# EAGLE board keyboard (EAGLE 9.6.1), part 1 of 3
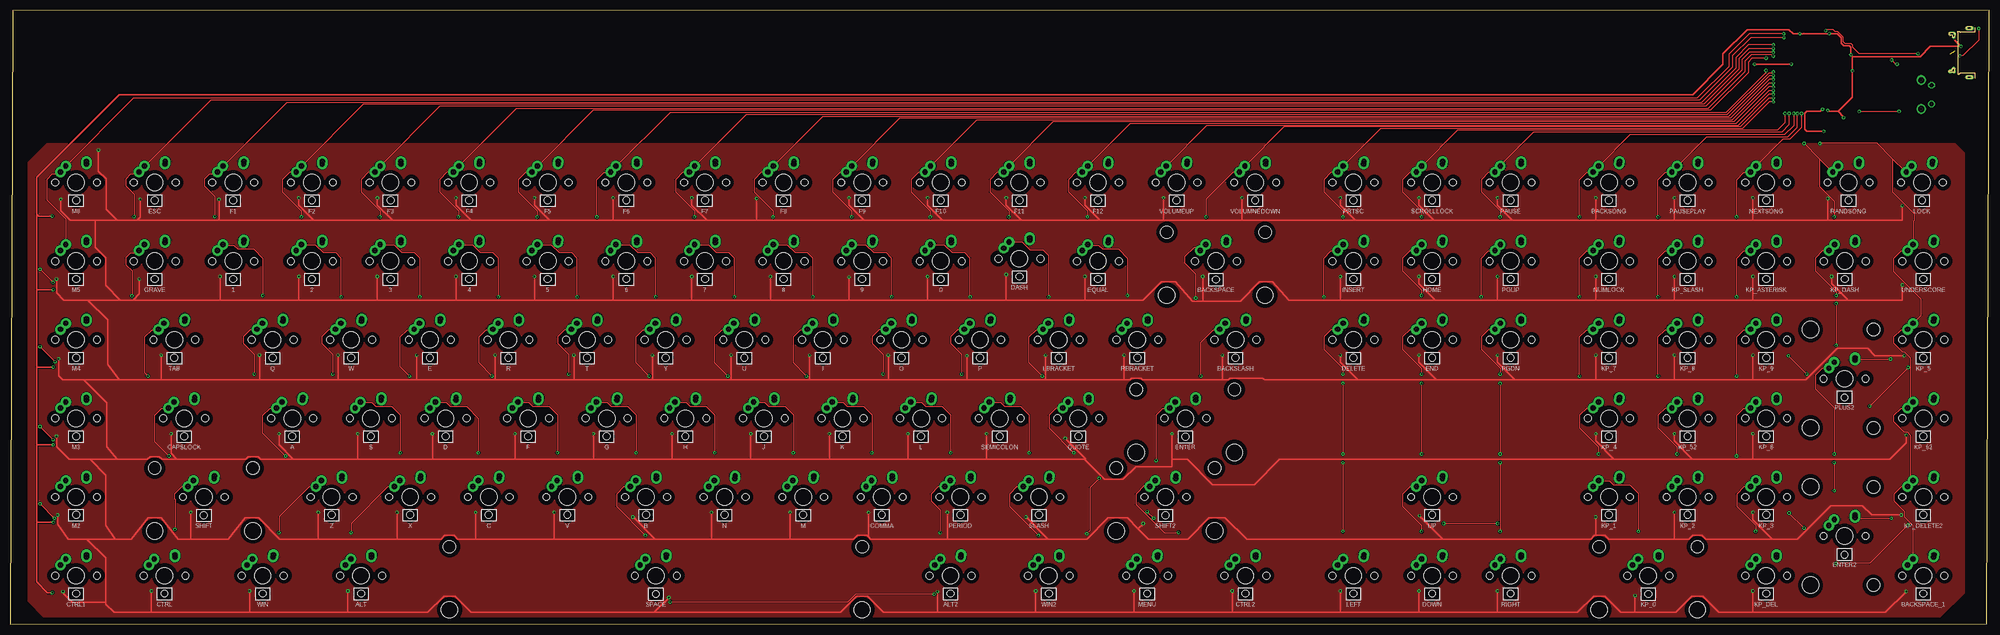
[diagram p6: board, top side]
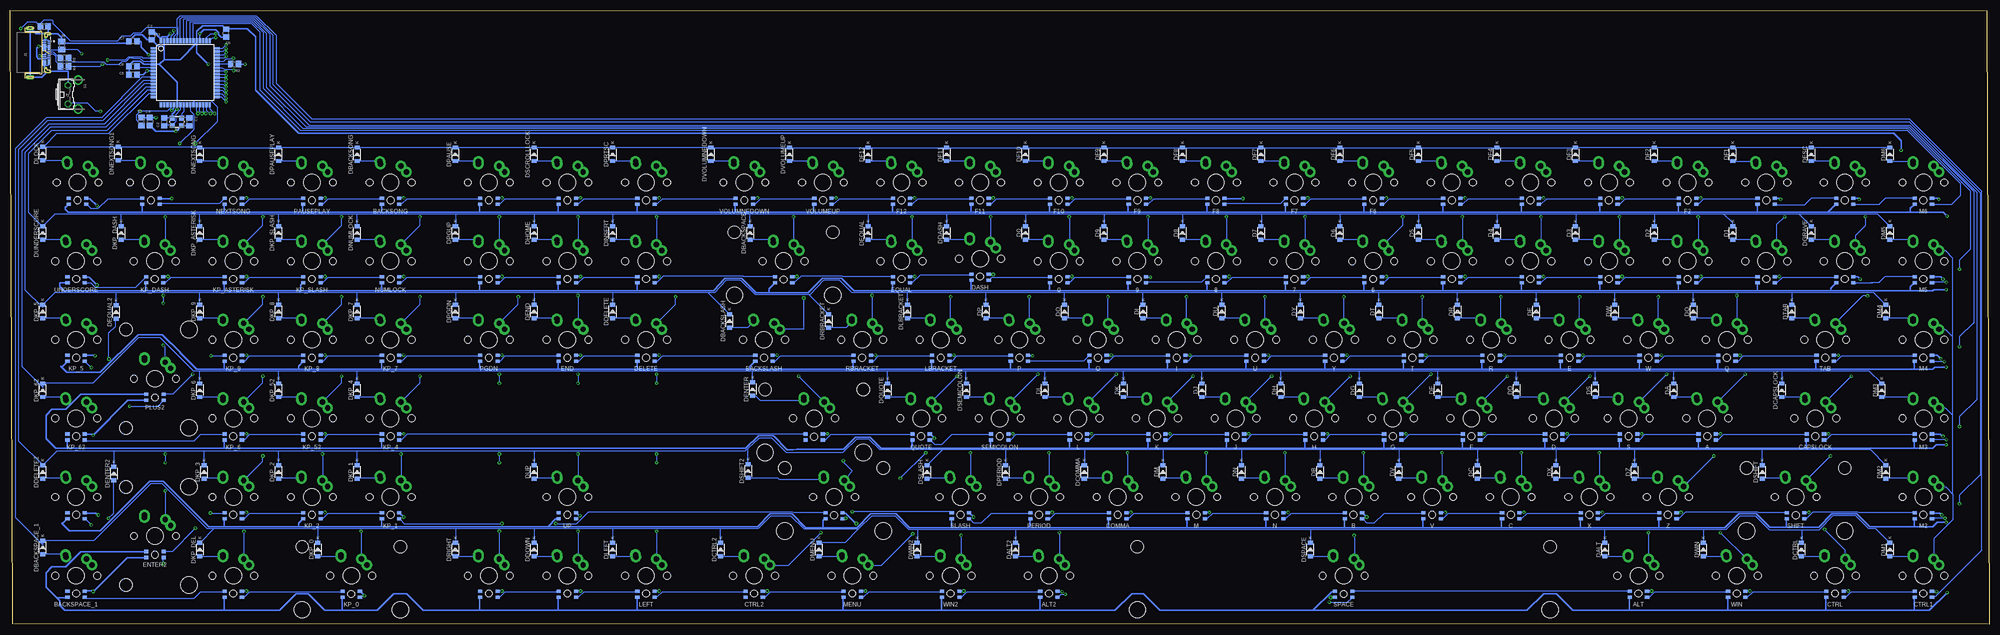
[diagram p7: board, bottom side, seen from below]

Size 479.57 x 148.74 mm. Coordinates in mm from the lower left corner, seen from the top.
Outline: 0,0 479.01,0.14 479.57,148.74 0.56,148.6 0,0
Copper layers (1*16): Top 0.035mm / dielectric 1.5mm / Bottom 0.035mm
Design rules "default *": minimum track width 6mil, minimum drill 0.35mm, track to track 6mil, track to pad 6mil, pad to pad 6mil, via to via 6mil, smd to smd 6mil, copper to edge 40mil, drill to drill 6mil, minimum pad ring 10mil, minimum via ring 8mil, stop-mask expansion 4mil, vias tented up to drill 0mil, thermal gap 10mil
Net classes: 0 default: width 0.2 mm; 1 POWER: width 0.406 mm

## Footprints (pad centres in the part's own frame; a part is rotated, then mirrored left to right if it is on the bottom)
ALPSMX-1U-SMDRGB = drill 1.3 pad 2.54: ALPS1 -2.5,4; ALPS2 2.5,4.5; MX1 -3.81,2.54; MX2 2.54,5.08 | smd 1 x 0.75 bottom: DIN -2.1,-5.225; DOUT 2.1,-3.775; VDD 2.1,-5.225; VSS -2.1,-3.775 | hole 4: 0,0 | hole 1.7: -5.08,0; 5.08,0; 0,-4.318
ALPSMX-2U-SMDRGB = drill 1.3 pad 2.54: ALPS1 -2.5,4; ALPS2 2.5,4.5; MX1 -3.81,2.54; MX2 2.54,5.08 | smd 1 x 0.75 bottom: DIN -2.1,-5.225; DOUT 2.1,-3.775; VDD 2.1,-5.225; VSS -2.1,-3.775 | hole 4: 0,0; -11.9,-8.24; 11.9,-8.24 | hole 1.7: -5.08,0; 5.08,0; 0,-4.445 | hole 3.05: -11.9,7; 11.9,7
C0805 = smd 1.3 x 1.5: 1 -0.95,0; 2 0.95,0
SOD-123 = smd 0.91 x 1.22: A -1.635,0; C 1.635,0
ALPSMX-2U-SMDRGB-ROTATED = drill 1.3 pad 2.54: ALPS1 -2.5,4; ALPS2 2.5,4.5; MX1 -3.81,2.54; MX2 2.54,5.08 | smd 1 x 0.75 bottom: DIN -2.1,-5.225; DOUT 2.1,-3.775; VDD 2.1,-5.225; VSS -2.1,-3.775 | hole 4: 0,0; -8.24,-11.9; -8.24,11.9 | hole 1.7: -5.08,0; 5.08,0; 0,-4.572 | hole 3.05: 7,-11.9; 7,11.9
TQFP64 = smd 1.194 x 0.559: 1 -7.76,5.905; 2 -7.76,5.118; 3 -7.76,4.331; 4 -7.76,3.543; 5 -7.76,2.756; 6 -7.76,1.968; 7 -7.76,1.181; 8 -7.76,0.394; 9 -7.76,-0.394; 10 -7.76,-1.181; 11 -7.76,-1.968; 12 -7.76,-2.756; 13 -7.76,-3.543; 14 -7.76,-4.331; 15 -7.76,-5.118; 16 -7.76,-5.905; 33 7.76,-5.905; 34 7.76,-5.118; 35 7.76,-4.331; 36 7.76,-3.543; 37 7.76,-2.756; 38 7.76,-1.968; 39 7.76,-1.181; 40 7.76,-0.394; 41 7.76,0.394; 42 7.76,1.181; 43 7.76,1.968; 44 7.76,2.756; 45 7.76,3.543; 46 7.76,4.331; 47 7.76,5.118; 48 7.76,5.905 | smd 0.559 x 1.194: 17 -5.905,-7.76; 18 -5.118,-7.76; 19 -4.331,-7.76; 20 -3.543,-7.76; 21 -2.756,-7.76; 22 -1.968,-7.76; 23 -1.181,-7.76; 24 -0.394,-7.76; 25 0.394,-7.76; 26 1.181,-7.76; 27 1.968,-7.76; 28 2.756,-7.76; 29 3.543,-7.76; 30 4.331,-7.76; 31 5.118,-7.76; 32 5.905,-7.76; 49 5.905,7.76; 50 5.118,7.76; 51 4.331,7.76; 52 3.543,7.76; 53 2.756,7.76; 54 1.968,7.76; 55 1.181,7.76; 56 0.394,7.76; 57 -0.394,7.76; 58 -1.181,7.76; 59 -1.968,7.76; 60 -2.756,7.76; 61 -3.543,7.76; 62 -4.331,7.76; 63 -5.118,7.76; 64 -5.905,7.76
TE_1-2295018-2 = smd 0.3 x 0.8: A1 -2.75,4.63; A2 -2.25,4.63; A3 -1.75,4.63; A4 -1.25,4.63; A5 -0.75,4.63; A6 -0.25,4.63; A7 0.25,4.63; A8 0.75,4.63; A9 1.25,4.63; A10 1.75,4.63; A11 2.25,4.63; A12 2.75,4.63; B1 3,3.43; B2 2.5,3.43; B3 2,3.43; B4 1.5,3.43; B5 1,3.43; B6 0.5,3.43; B7 -0.5,3.43; B8 -1,3.43; B9 -1.5,3.43; B10 -2,3.43; B11 -2.5,3.43; B12 -3,3.43 | drill 0.5 long: P1_1 -4.55,4.22; P2_1 4.55,4.22 | drill 0.35 long: P1_2 -4.191,3.795; P2_2 4.191,3.795 | drill 0.5 pad 1.1 long: P4 -5.97,0; P5 5.97,0
M0805 = smd 1.3 x 1.6: 1 -0.95,0; 2 0.95,0
B3F-31XX = drill 1.016 octagon: 1 -2.261,-1.245; 2 2.261,-1.245 | drill 1.499 pad 2.159: 3 -3.505,1.245; 4 3.505,1.245
ALPSMX-6.25U-SMDRGB = drill 1.3 pad 2.54: ALPS1 -2.5,4; ALPS2 2.5,4.5; MX1 -3.81,2.54; MX2 2.54,5.08 | smd 1 x 0.75 bottom: DIN 2.1,-3.775; DOUT -2.1,-5.225; VDD 2.1,-5.225; VSS -2.1,-3.775 | hole 4: 0,0; -50,-8.24; 50,-8.24 | hole 1.7: -5.08,0; 5.08,0; 0,-4.445 | hole 3.05: -50,7; 50,7
CRYSTAL-SMD-3.2X2.5MM = smd 1.2 x 1.1: 1 -1.175,-0.875; 2 1.175,-0.875; 3 1.175,0.875; 4 -1.175,0.875

## Placement (x,y rotation side)
0  KEYSWITCH-RGBSMDLED-ALPSMX-1U-SMDRGB  [ALPSMX-1U-SMDRGB]  225.49,87.97 0 top
1  KEYSWITCH-RGBSMDLED-ALPSMX-1U-SMDRGB  [ALPSMX-1U-SMDRGB]  54.04,87.97 0 top
2  KEYSWITCH-RGBSMDLED-ALPSMX-1U-SMDRGB  [ALPSMX-1U-SMDRGB]  73.09,87.97 0 top
3  KEYSWITCH-RGBSMDLED-ALPSMX-1U-SMDRGB  [ALPSMX-1U-SMDRGB]  92.14,87.97 0 top
4  KEYSWITCH-RGBSMDLED-ALPSMX-1U-SMDRGB  [ALPSMX-1U-SMDRGB]  111.19,87.97 0 top
5  KEYSWITCH-RGBSMDLED-ALPSMX-1U-SMDRGB  [ALPSMX-1U-SMDRGB]  130.24,87.97 0 top
6  KEYSWITCH-RGBSMDLED-ALPSMX-1U-SMDRGB  [ALPSMX-1U-SMDRGB]  149.29,87.97 0 top
7  KEYSWITCH-RGBSMDLED-ALPSMX-1U-SMDRGB  [ALPSMX-1U-SMDRGB]  168.34,87.97 0 top
8  KEYSWITCH-RGBSMDLED-ALPSMX-1U-SMDRGB  [ALPSMX-1U-SMDRGB]  187.39,87.97 0 top
9  KEYSWITCH-RGBSMDLED-ALPSMX-1U-SMDRGB  [ALPSMX-1U-SMDRGB]  206.44,87.97 0 top
A  KEYSWITCH-RGBSMDLED-ALPSMX-1U-SMDRGB  [ALPSMX-1U-SMDRGB]  68.33,49.87 0 top
ALT  KEYSWITCH-RGBSMDLED-ALPSMX-1U-SMDRGB  [ALPSMX-1U-SMDRGB]  85,11.77 0 top
ALT2  KEYSWITCH-RGBSMDLED-ALPSMX-1U-SMDRGB  [ALPSMX-1U-SMDRGB]  227.87,11.77 0 top
B  KEYSWITCH-RGBSMDLED-ALPSMX-1U-SMDRGB  [ALPSMX-1U-SMDRGB]  154.05,30.82 0 top
BACKSLASH  KEYSWITCH-RGBSMDLED-ALPSMX-1U-SMDRGB  [ALPSMX-1U-SMDRGB]  296.93,68.92 0 top
BACKSONG  KEYSWITCH-RGBSMDLED-ALPSMX-1U-SMDRGB  [ALPSMX-1U-SMDRGB]  387.42,107.02 0 top
BACKSPACE  KEYSWITCH-RGBSMDLED-ALPSMX-2U-SMDRGB  [ALPSMX-2U-SMDRGB]  292.17,87.97 0 top
BACKSPACE_1  KEYSWITCH-RGBSMDLED-ALPSMX-1U-SMDRGB  [ALPSMX-1U-SMDRGB]  463.62,11.77 0 top
C  KEYSWITCH-RGBSMDLED-ALPSMX-1U-SMDRGB  [ALPSMX-1U-SMDRGB]  115.95,30.82 0 top
C1  22pF  [C0805]  436.14,121.72 270 bottom
C2  22pF  [C0805]  442.24,121.72 90 bottom
C3  0.1uF  [C0805]  445.29,142.57 270 bottom
C4  0.1uF  [C0805]  445.77,121.82 270 bottom
C5  0.1uF  [C0805]  449.86,133.12 180 bottom
C6  0.1uF  [C0805]  427.28,143.2 90 bottom
C7  0.1uF  [C0805]  449.86,141.27 180 bottom
C8  1u  [C0805]  449.86,135.18 0 bottom
CAPSLOCK  KEYSWITCH-RGBSMDLED-ALPSMX-1U-SMDRGB  [ALPSMX-1U-SMDRGB]  42.13,49.87 0 top
COMMA  KEYSWITCH-RGBSMDLED-ALPSMX-1U-SMDRGB  [ALPSMX-1U-SMDRGB]  211.2,30.82 0 top
CTRL  KEYSWITCH-RGBSMDLED-ALPSMX-1U-SMDRGB  [ALPSMX-1U-SMDRGB]  37.37,11.77 0 top
CTRL1  KEYSWITCH-RGBSMDLED-ALPSMX-1U-SMDRGB  [ALPSMX-1U-SMDRGB]  15.94,11.77 0 top
CTRL2  KEYSWITCH-RGBSMDLED-ALPSMX-1U-SMDRGB  [ALPSMX-1U-SMDRGB]  299.31,11.77 0 top
D  KEYSWITCH-RGBSMDLED-ALPSMX-1U-SMDRGB  [ALPSMX-1U-SMDRGB]  105.51,49.87 0 top
D0  [SOD-123]  233.6,94.81 90 bottom
D1  [SOD-123]  62.15,94.81 90 bottom
D2  [SOD-123]  81.2,94.81 90 bottom
D3  [SOD-123]  100.25,94.81 90 bottom
D4  [SOD-123]  119.3,94.81 90 bottom
D5  [SOD-123]  138.35,94.81 90 bottom
D6  [SOD-123]  157.4,94.81 90 bottom
D7  [SOD-123]  176.45,94.81 90 bottom
D8  [SOD-123]  195.5,94.81 90 bottom
D9  [SOD-123]  214.55,94.81 90 bottom
DA  [SOD-123]  76.44,56.71 90 bottom
DALT  [SOD-123]  93.11,18.1 90 bottom
DALT2  [SOD-123]  235.98,18.1 90 bottom
DASH  KEYSWITCH-RGBSMDLED-ALPSMX-1U-SMDRGB  [ALPSMX-1U-SMDRGB]  244.54,88.57 0 top
DB  [SOD-123]  162.16,36.89 90 bottom
DBACKSLASH  [SOD-123]  305.3,73.47 90 bottom
DBACKSONG  [SOD-123]  395.53,113.86 90 bottom
DBACKSPACE  [SOD-123]  300.28,94.81 90 bottom
DBACKSPACE_1  [SOD-123]  471.73,18.61 90 bottom
DC  [SOD-123]  124.06,36.89 90 bottom
DCAPSLOCK  [SOD-123]  50.24,56.71 90 bottom
DCOMMA  [SOD-123]  219.31,36.89 90 bottom
DCTRL  [SOD-123]  45.48,18.1 90 bottom
DCTRL2  [SOD-123]  307.42,18.1 90 bottom
DD  [SOD-123]  114.54,56.71 90 bottom
DDASH  [SOD-123]  252.65,94.81 90 bottom
DDELETE  [SOD-123]  333.61,75.76 90 bottom
DDELETE2  [SOD-123]  471.73,36.89 90 bottom
DDOWN  [SOD-123]  352.66,18.1 90 bottom
DE  [SOD-123]  109.78,75.76 90 bottom
DELETE  KEYSWITCH-RGBSMDLED-ALPSMX-1U-SMDRGB  [ALPSMX-1U-SMDRGB]  325.5,68.92 0 top
DEND  [SOD-123]  352.66,75.76 90 bottom
DENTER  [SOD-123]  299.67,56.96 90 bottom
DENTER2  [SOD-123]  454.46,36.52 90 bottom
DEQUAL  [SOD-123]  271.7,94.81 90 bottom
DEQUAL2  [SOD-123]  453.95,75.63 90 bottom
DESC  [SOD-123]  43.1,113.86 90 bottom
DF  [SOD-123]  133.59,56.71 90 bottom
DF1  [SOD-123]  62.15,113.86 90 bottom
DF2  [SOD-123]  81.2,113.86 90 bottom
DF3  [SOD-123]  100.25,113.86 90 bottom
DF4  [SOD-123]  119.3,113.86 90 bottom
DF5  [SOD-123]  138.35,113.86 90 bottom
DF6  [SOD-123]  157.4,113.86 90 bottom
DF7  [SOD-123]  176.45,113.86 90 bottom
DF8  [SOD-123]  195.5,113.86 90 bottom
DF9  [SOD-123]  214.55,113.86 90 bottom
DF10  [SOD-123]  233.6,113.86 90 bottom
DF11  [SOD-123]  252.65,113.86 90 bottom
DF12  [SOD-123]  271.7,113.86 90 bottom
DG  [SOD-123]  152.64,56.71 90 bottom
DGRAVE  [SOD-123]  43.1,94.81 90 bottom
DH  [SOD-123]  171.69,56.71 90 bottom
DHOME  [SOD-123]  352.66,94.81 90 bottom
DI  [SOD-123]  205.03,75.76 90 bottom
DINSERT  [SOD-123]  333.61,94.81 90 bottom
DJ  [SOD-123]  190.74,56.71 90 bottom
DK  [SOD-123]  209.79,56.71 90 bottom
DKP_0  [SOD-123]  405.05,18.1 90 bottom
DKP_1  [SOD-123]  395.53,36.89 90 bottom
DKP_2  [SOD-123]  414.58,36.89 90 bottom
DKP_3  [SOD-123]  432.62,36.89 90 bottom
DKP_4  [SOD-123]  395.53,56.71 90 bottom
DKP_5  [SOD-123]  471.73,75.76 90 bottom
DKP_6  [SOD-123]  433.63,56.71 90 bottom
DKP_7  [SOD-123]  395.53,75.76 90 bottom
DKP_8  [SOD-123]  414.58,75.76 90 bottom
DKP_9  [SOD-123]  433.63,75.76 90 bottom
DKP_52  [SOD-123]  414.58,56.71 90 bottom
DKP_62  [SOD-123]  471.73,56.71 90 bottom
DKP_ASTERISK  [SOD-123]  433.63,94.81 90 bottom
DKP_DASH  [SOD-123]  452.68,94.81 90 bottom
DKP_DEL  [SOD-123]  433.63,18.1 90 bottom
DKP_SLASH  [SOD-123]  414.58,94.81 90 bottom
DL  [SOD-123]  228.84,56.71 90 bottom
DLBRACKET  [SOD-123]  262.18,75.76 90 bottom
DLEFT  [SOD-123]  333.61,18.1 90 bottom
DLOCK  [SOD-123]  471.73,114.07 90 bottom
DM  [SOD-123]  200.26,36.89 90 bottom
DM1  [SOD-123]  24.05,18.1 90 bottom
DM2  [SOD-123]  25.05,36.89 90 bottom
DM3  [SOD-123]  26.05,56.71 90 bottom
DM4  [SOD-123]  25.05,75.76 90 bottom
DM5  [SOD-123]  24.05,94.81 90 bottom
DM6  [SOD-123]  24.05,113.86 90 bottom
DMENU  [SOD-123]  283.61,18.1 90 bottom
DN  [SOD-123]  181.21,36.89 90 bottom
DNEXTSONG  [SOD-123]  433.63,113.86 90 bottom
DNEXTSONG1  [SOD-123]  453.47,114.07 90 bottom
DNUMLOCK  [SOD-123]  395.53,94.81 90 bottom
DO  [SOD-123]  224.08,75.76 90 bottom
DOWN  KEYSWITCH-RGBSMDLED-ALPSMX-1U-SMDRGB  [ALPSMX-1U-SMDRGB]  344.55,11.77 0 top
DP  [SOD-123]  243.13,75.76 90 bottom
DPAUSE  [SOD-123]  371.71,113.86 90 bottom
DPAUSEPLAY  [SOD-123]  414.58,113.86 90 bottom
DPERIOD  [SOD-123]  238.36,36.89 90 bottom
DPGDN  [SOD-123]  371.71,75.76 90 bottom
DPGUP  [SOD-123]  371.71,94.81 90 bottom
DPRTSC  [SOD-123]  333.61,113.86 90 bottom
DQ  [SOD-123]  71.68,75.76 90 bottom
DQUOTE  [SOD-123]  266.94,56.71 90 bottom
DR  [SOD-123]  128.83,75.76 90 bottom
DRBRACKET  [SOD-123]  281.23,73.47 90 bottom
DRIGHT  [SOD-123]  371.71,18.1 90 bottom
DS  [SOD-123]  95.49,56.71 90 bottom
DSCROLLLOCK  [SOD-123]  352.66,113.86 90 bottom
DSEMICOLON  [SOD-123]  247.89,56.71 90 bottom
DSHIFT  [SOD-123]  55.01,36.89 90 bottom
DSHIFT2  [SOD-123]  300.75,37.15 90 bottom
DSLASH  [SOD-123]  257.41,36.89 90 bottom
DSPACE  [SOD-123]  164.54,18.1 90 bottom
DT  [SOD-123]  147.88,75.76 90 bottom
DTAB  [SOD-123]  47.86,75.76 90 bottom
DU  [SOD-123]  185.98,75.76 90 bottom
DUNDERSCORE  [SOD-123]  471.73,94.81 90 bottom
DUP  [SOD-123]  352.66,36.89 90 bottom
DV  [SOD-123]  143.11,36.89 90 bottom
DVOLUMEUP  [SOD-123]  290.75,113.86 90 bottom
DVOLUMNEDOWN  [SOD-123]  309.8,113.86 90 bottom
DW  [SOD-123]  90.73,75.76 90 bottom
DWIN  [SOD-123]  69.29,18.1 90 bottom
DWIN2  [SOD-123]  259.79,18.1 90 bottom
DX  [SOD-123]  105.01,36.89 90 bottom
DY  [SOD-123]  166.93,75.76 90 bottom
DZ  [SOD-123]  85.96,36.89 90 bottom
E  KEYSWITCH-RGBSMDLED-ALPSMX-1U-SMDRGB  [ALPSMX-1U-SMDRGB]  101.67,68.92 0 top
END  KEYSWITCH-RGBSMDLED-ALPSMX-1U-SMDRGB  [ALPSMX-1U-SMDRGB]  344.55,68.92 0 top
ENTER  KEYSWITCH-RGBSMDLED-ALPSMX-2U-SMDRGB  [ALPSMX-2U-SMDRGB]  284.77,49.87 0 top
ENTER2  KEYSWITCH-RGBSMDLED-ALPSMX-2U-SMDRGB-ROTATED  [ALPSMX-2U-SMDRGB-ROTATED]  444.52,21.39 0 top
EQUAL  KEYSWITCH-RGBSMDLED-ALPSMX-1U-SMDRGB  [ALPSMX-1U-SMDRGB]  263.59,87.97 0 top
ESC  KEYSWITCH-RGBSMDLED-ALPSMX-1U-SMDRGB  [ALPSMX-1U-SMDRGB]  34.99,107.02 0 top
F  KEYSWITCH-RGBSMDLED-ALPSMX-1U-SMDRGB  [ALPSMX-1U-SMDRGB]  125.48,49.87 0 top
F1  KEYSWITCH-RGBSMDLED-ALPSMX-1U-SMDRGB  [ALPSMX-1U-SMDRGB]  54.04,107.02 0 top
F2  KEYSWITCH-RGBSMDLED-ALPSMX-1U-SMDRGB  [ALPSMX-1U-SMDRGB]  73.09,107.02 0 top
F3  KEYSWITCH-RGBSMDLED-ALPSMX-1U-SMDRGB  [ALPSMX-1U-SMDRGB]  92.14,107.02 0 top
F4  KEYSWITCH-RGBSMDLED-ALPSMX-1U-SMDRGB  [ALPSMX-1U-SMDRGB]  111.19,107.02 0 top
F5  KEYSWITCH-RGBSMDLED-ALPSMX-1U-SMDRGB  [ALPSMX-1U-SMDRGB]  130.24,107.02 0 top
F6  KEYSWITCH-RGBSMDLED-ALPSMX-1U-SMDRGB  [ALPSMX-1U-SMDRGB]  149.29,107.02 0 top
F7  KEYSWITCH-RGBSMDLED-ALPSMX-1U-SMDRGB  [ALPSMX-1U-SMDRGB]  168.34,107.02 0 top
F8  KEYSWITCH-RGBSMDLED-ALPSMX-1U-SMDRGB  [ALPSMX-1U-SMDRGB]  187.39,107.02 0 top
F9  KEYSWITCH-RGBSMDLED-ALPSMX-1U-SMDRGB  [ALPSMX-1U-SMDRGB]  206.44,107.02 0 top
F10  KEYSWITCH-RGBSMDLED-ALPSMX-1U-SMDRGB  [ALPSMX-1U-SMDRGB]  225.49,107.02 0 top
F11  KEYSWITCH-RGBSMDLED-ALPSMX-1U-SMDRGB  [ALPSMX-1U-SMDRGB]  244.54,107.02 0 top
F12  KEYSWITCH-RGBSMDLED-ALPSMX-1U-SMDRGB  [ALPSMX-1U-SMDRGB]  263.59,107.02 0 top
G  KEYSWITCH-RGBSMDLED-ALPSMX-1U-SMDRGB  [ALPSMX-1U-SMDRGB]  144.53,49.87 0 top
GRAVE  KEYSWITCH-RGBSMDLED-ALPSMX-1U-SMDRGB  [ALPSMX-1U-SMDRGB]  34.99,87.97 0 top
H  KEYSWITCH-RGBSMDLED-ALPSMX-1U-SMDRGB  [ALPSMX-1U-SMDRGB]  163.58,49.87 0 top
HOME  KEYSWITCH-RGBSMDLED-ALPSMX-1U-SMDRGB  [ALPSMX-1U-SMDRGB]  344.55,87.97 0 top
I  KEYSWITCH-RGBSMDLED-ALPSMX-1U-SMDRGB  [ALPSMX-1U-SMDRGB]  196.92,68.92 0 top
IC3  [TQFP64]  437.16,133.65 0 bottom
INSERT  KEYSWITCH-RGBSMDLED-ALPSMX-1U-SMDRGB  [ALPSMX-1U-SMDRGB]  325.5,87.97 0 top
J  KEYSWITCH-RGBSMDLED-ALPSMX-1U-SMDRGB  [ALPSMX-1U-SMDRGB]  182.63,49.87 0 top
J1  1-2295018-2  [TE_1-2295018-2]  474.75,138.48 270 bottom
K  KEYSWITCH-RGBSMDLED-ALPSMX-1U-SMDRGB  [ALPSMX-1U-SMDRGB]  201.68,49.87 0 top
KP_0  KEYSWITCH-RGBSMDLED-ALPSMX-2U-SMDRGB  [ALPSMX-2U-SMDRGB]  396.94,11.77 0 top
KP_1  KEYSWITCH-RGBSMDLED-ALPSMX-1U-SMDRGB  [ALPSMX-1U-SMDRGB]  387.42,30.82 0 top
KP_2  KEYSWITCH-RGBSMDLED-ALPSMX-1U-SMDRGB  [ALPSMX-1U-SMDRGB]  406.47,30.82 0 top
KP_3  KEYSWITCH-RGBSMDLED-ALPSMX-1U-SMDRGB  [ALPSMX-1U-SMDRGB]  425.52,30.82 0 top
KP_4  KEYSWITCH-RGBSMDLED-ALPSMX-1U-SMDRGB  [ALPSMX-1U-SMDRGB]  387.42,49.87 0 top
KP_5  KEYSWITCH-RGBSMDLED-ALPSMX-1U-SMDRGB  [ALPSMX-1U-SMDRGB]  463.62,68.92 0 top
KP_6  KEYSWITCH-RGBSMDLED-ALPSMX-1U-SMDRGB  [ALPSMX-1U-SMDRGB]  425.52,49.87 0 top
KP_7  KEYSWITCH-RGBSMDLED-ALPSMX-1U-SMDRGB  [ALPSMX-1U-SMDRGB]  387.42,68.92 0 top
KP_8  KEYSWITCH-RGBSMDLED-ALPSMX-1U-SMDRGB  [ALPSMX-1U-SMDRGB]  406.47,68.92 0 top
KP_9  KEYSWITCH-RGBSMDLED-ALPSMX-1U-SMDRGB  [ALPSMX-1U-SMDRGB]  425.52,68.92 0 top
KP_52  KEYSWITCH-RGBSMDLED-ALPSMX-1U-SMDRGB  [ALPSMX-1U-SMDRGB]  406.47,49.87 0 top
KP_62  KEYSWITCH-RGBSMDLED-ALPSMX-1U-SMDRGB  [ALPSMX-1U-SMDRGB]  463.62,49.87 0 top
KP_ASTERISK  KEYSWITCH-RGBSMDLED-ALPSMX-1U-SMDRGB  [ALPSMX-1U-SMDRGB]  425.52,87.97 0 top
KP_DASH  KEYSWITCH-RGBSMDLED-ALPSMX-1U-SMDRGB  [ALPSMX-1U-SMDRGB]  444.57,87.97 0 top
KP_DEL  KEYSWITCH-RGBSMDLED-ALPSMX-1U-SMDRGB  [ALPSMX-1U-SMDRGB]  425.52,11.77 0 top
KP_DELETE2  KEYSWITCH-RGBSMDLED-ALPSMX-1U-SMDRGB  [ALPSMX-1U-SMDRGB]  463.62,30.82 0 top
KP_SLASH  KEYSWITCH-RGBSMDLED-ALPSMX-1U-SMDRGB  [ALPSMX-1U-SMDRGB]  406.47,87.97 0 top
L  KEYSWITCH-RGBSMDLED-ALPSMX-1U-SMDRGB  [ALPSMX-1U-SMDRGB]  220.73,49.87 0 top
LBRACKET  KEYSWITCH-RGBSMDLED-ALPSMX-1U-SMDRGB  [ALPSMX-1U-SMDRGB]  254.07,68.92 0 top
LEFT  KEYSWITCH-RGBSMDLED-ALPSMX-1U-SMDRGB  [ALPSMX-1U-SMDRGB]  325.5,11.77 0 top
LOCK  KEYSWITCH-RGBSMDLED-ALPSMX-1U-SMDRGB  [ALPSMX-1U-SMDRGB]  463.27,107.02 0 top
M  KEYSWITCH-RGBSMDLED-ALPSMX-1U-SMDRGB  [ALPSMX-1U-SMDRGB]  192.15,30.82 0 top
M2  KEYSWITCH-RGBSMDLED-ALPSMX-1U-SMDRGB  [ALPSMX-1U-SMDRGB]  15.94,30.82 0 top
M3  KEYSWITCH-RGBSMDLED-ALPSMX-1U-SMDRGB  [ALPSMX-1U-SMDRGB]  15.94,49.87 0 top
M4  KEYSWITCH-RGBSMDLED-ALPSMX-1U-SMDRGB  [ALPSMX-1U-SMDRGB]  15.94,68.92 0 top
M5  KEYSWITCH-RGBSMDLED-ALPSMX-1U-SMDRGB  [ALPSMX-1U-SMDRGB]  15.94,87.97 0 top
M6  KEYSWITCH-RGBSMDLED-ALPSMX-1U-SMDRGB  [ALPSMX-1U-SMDRGB]  15.94,107.02 0 top
MENU  KEYSWITCH-RGBSMDLED-ALPSMX-1U-SMDRGB  [ALPSMX-1U-SMDRGB]  275.5,11.77 0 top
N  KEYSWITCH-RGBSMDLED-ALPSMX-1U-SMDRGB  [ALPSMX-1U-SMDRGB]  173.1,30.82 0 top
NEXTSONG  KEYSWITCH-RGBSMDLED-ALPSMX-1U-SMDRGB  [ALPSMX-1U-SMDRGB]  425.52,107.02 0 top
NUMLOCK  KEYSWITCH-RGBSMDLED-ALPSMX-1U-SMDRGB  [ALPSMX-1U-SMDRGB]  387.42,87.97 0 top
O  KEYSWITCH-RGBSMDLED-ALPSMX-1U-SMDRGB  [ALPSMX-1U-SMDRGB]  215.97,68.92 0 top
P  KEYSWITCH-RGBSMDLED-ALPSMX-1U-SMDRGB  [ALPSMX-1U-SMDRGB]  235.02,68.92 0 top
PAUSE  KEYSWITCH-RGBSMDLED-ALPSMX-1U-SMDRGB  [ALPSMX-1U-SMDRGB]  363.6,107.02 0 top
PAUSEPLAY  KEYSWITCH-RGBSMDLED-ALPSMX-1U-SMDRGB  [ALPSMX-1U-SMDRGB]  406.47,107.02 0 top
PERIOD  KEYSWITCH-RGBSMDLED-ALPSMX-1U-SMDRGB  [ALPSMX-1U-SMDRGB]  230.25,30.82 0 top
PGDN  KEYSWITCH-RGBSMDLED-ALPSMX-1U-SMDRGB  [ALPSMX-1U-SMDRGB]  363.6,68.92 0 top
PGUP  KEYSWITCH-RGBSMDLED-ALPSMX-1U-SMDRGB  [ALPSMX-1U-SMDRGB]  363.6,87.97 0 top
PLUS2  KEYSWITCH-RGBSMDLED-ALPSMX-2U-SMDRGB-ROTATED  [ALPSMX-2U-SMDRGB-ROTATED]  444.52,59.49 0 top
PRTSC  KEYSWITCH-RGBSMDLED-ALPSMX-1U-SMDRGB  [ALPSMX-1U-SMDRGB]  325.5,107.02 0 top
Q  KEYSWITCH-RGBSMDLED-ALPSMX-1U-SMDRGB  [ALPSMX-1U-SMDRGB]  63.57,68.92 0 top
QUOTE  KEYSWITCH-RGBSMDLED-ALPSMX-1U-SMDRGB  [ALPSMX-1U-SMDRGB]  258.83,49.87 0 top
R  KEYSWITCH-RGBSMDLED-ALPSMX-1U-SMDRGB  [ALPSMX-1U-SMDRGB]  120.72,68.92 0 top
R1  10k  [M0805]  447.8,121.82 270 bottom
R2  10k  [M0805]  425.22,135.69 180 bottom
R3  22  [M0805]  466.42,137.21 0 bottom
R4  22  [M0805]  466.42,135.18 0 bottom
R5  5.1k  [M0805]  467.1,140.23 90 bottom
R6  5.1k  [M0805]  471.35,144.83 180 bottom
RANDSONG  KEYSWITCH-RGBSMDLED-ALPSMX-1U-SMDRGB  [ALPSMX-1U-SMDRGB]  445.47,107.02 0 top
RBRACKET  KEYSWITCH-RGBSMDLED-ALPSMX-1U-SMDRGB  [ALPSMX-1U-SMDRGB]  273.12,68.92 0 top
RIGHT  KEYSWITCH-RGBSMDLED-ALPSMX-1U-SMDRGB  [ALPSMX-1U-SMDRGB]  363.6,11.77 0 top
S  KEYSWITCH-RGBSMDLED-ALPSMX-1U-SMDRGB  [ALPSMX-1U-SMDRGB]  87.38,49.87 0 top
S1  [B3F-31XX]  464.33,128.32 270 bottom
SCROLLLOCK  KEYSWITCH-RGBSMDLED-ALPSMX-1U-SMDRGB  [ALPSMX-1U-SMDRGB]  344.55,107.02 0 top
SEMICOLON  KEYSWITCH-RGBSMDLED-ALPSMX-1U-SMDRGB  [ALPSMX-1U-SMDRGB]  239.78,49.87 0 top
SHIFT  KEYSWITCH-RGBSMDLED-ALPSMX-2U-SMDRGB  [ALPSMX-2U-SMDRGB]  46.9,30.82 0 top
SHIFT2  KEYSWITCH-RGBSMDLED-ALPSMX-2U-SMDRGB  [ALPSMX-2U-SMDRGB]  279.94,30.82 0 top
SLASH  KEYSWITCH-RGBSMDLED-ALPSMX-1U-SMDRGB  [ALPSMX-1U-SMDRGB]  249.3,30.82 0 top
SPACE  KEYSWITCH-RGBSMDLED-ALPSMX-6.25U-SMDRGB  [ALPSMX-6.25U-SMDRGB]  156.43,11.77 0 top
T  KEYSWITCH-RGBSMDLED-ALPSMX-1U-SMDRGB  [ALPSMX-1U-SMDRGB]  139.77,68.92 0 top
TAB  KEYSWITCH-RGBSMDLED-ALPSMX-1U-SMDRGB  [ALPSMX-1U-SMDRGB]  39.75,68.92 0 top
U  KEYSWITCH-RGBSMDLED-ALPSMX-1U-SMDRGB  [ALPSMX-1U-SMDRGB]  177.87,68.92 0 top
UNDERSCORE  KEYSWITCH-RGBSMDLED-ALPSMX-1U-SMDRGB  [ALPSMX-1U-SMDRGB]  463.62,87.97 0 top
UP  KEYSWITCH-RGBSMDLED-ALPSMX-1U-SMDRGB  [ALPSMX-1U-SMDRGB]  344.55,30.82 0 top
V  KEYSWITCH-RGBSMDLED-ALPSMX-1U-SMDRGB  [ALPSMX-1U-SMDRGB]  135,30.82 0 top
VOLUMEUP  KEYSWITCH-RGBSMDLED-ALPSMX-1U-SMDRGB  [ALPSMX-1U-SMDRGB]  282.64,107.02 0 top
VOLUMNEDOWN  KEYSWITCH-RGBSMDLED-ALPSMX-1U-SMDRGB  [ALPSMX-1U-SMDRGB]  301.69,107.02 0 top
W  KEYSWITCH-RGBSMDLED-ALPSMX-1U-SMDRGB  [ALPSMX-1U-SMDRGB]  82.62,68.92 0 top
WIN  KEYSWITCH-RGBSMDLED-ALPSMX-1U-SMDRGB  [ALPSMX-1U-SMDRGB]  61.18,11.77 0 top
WIN2  KEYSWITCH-RGBSMDLED-ALPSMX-1U-SMDRGB  [ALPSMX-1U-SMDRGB]  251.68,11.77 0 top
X  KEYSWITCH-RGBSMDLED-ALPSMX-1U-SMDRGB  [ALPSMX-1U-SMDRGB]  96.9,30.82 0 top
Y  KEYSWITCH-RGBSMDLED-ALPSMX-1U-SMDRGB  [ALPSMX-1U-SMDRGB]  158.82,68.92 0 top
Y2  CRYSTAL-GROUNDEDSMD-3.2X2.5  [CRYSTAL-SMD-3.2X2.5MM]  439.19,121.72 180 bottom
Z  KEYSWITCH-RGBSMDLED-ALPSMX-1U-SMDRGB  [ALPSMX-1U-SMDRGB]  77.85,30.82 0 top

## Tracks (layer width: path | path; a pad name or v marks a point on that pad's centre or on a via)
+5V  (via drill 0.35)
  Top 0.406: 472.69,139.98 v472.72,140 | v440.46,124.51 440.71,124.26 443,124.26 | v444.27,122.73 444.27,122.99 443,124.26 | 434.62,143.08 v433.67,143.08 432.05,143.08 431.06,144.07 420.9,144.07 415.06,138.23 415.06,135.69 407.69,128.32 26.44,128.32 6.37,108.25 6.37,99.36 | 434.62,143.08 v440.79,143.08 442.72,143.08 443.76,142.04 443.76,140.77 444.35,140.18 445.67,140.18 446.05,139.8 v446.05,137.97 | v446.05,137.97 446.4,137.62 v446.4,134.06 | v446.4,134.06 446.4,134.01 | v446.4,134.06 446.4,127.66 443,124.26 | v472.72,140 471.27,141.45 | 434.69,143.15 434.62,143.08 | v446.05,137.97 446.56,137.46 462.81,137.46 465.35,140 v472.72,140 | 6.37,99.36 6.37,81.08 | 6.37,81.08 6.37,62.28 | 6.37,62.28 6.37,43.48 | 6.37,43.48 6.37,24.69 | 6.37,24.69 6.37,10.26 8.96,7.67 v10.18,7.67 | 6.37,99.36 6.88,98.86 v10.18,98.86 | 6.37,81.08 v10.44,81.08 | 6.37,62.28 v10.44,62.28 | 6.37,43.48 v10.44,43.48 | 6.37,24.69 v10.44,24.69
  Bottom 0.2: J1.A4 470.18,139.73 470.27,139.83 470.62,139.83 470.78,139.98 J1.B9 | J1.A9 470.63,137.23 470.88,136.98 471.82,136.98 J1.B4
  Bottom 0.305: v472.72,140 472.69,139.98 J1.B9 | J1.B4 471.88,136.98
  Bottom 0.406: IC3.52 433.61,143.02 v433.67,143.08 432.68,144.07 429.74,144.07 429.04,143.36 429.04,142.81 428.49,142.25 C6.1 | v440.79,143.08 441.49,142.38 | 441.49,142.38 IC3.62 | 441.49,142.38 441.5,142.37 442.72,142.37 443.1,141.99 | 443.1,141.99 443.1,141.45 IC3.64 | 443.1,141.99 443.2,141.99 444.74,143.52 C3.1 | IC3.21 439.95,125.86 439.95,125.02 v440.46,124.51 | 444.9,137.97 IC3.3 446.03,137.99 v446.05,137.97 447.82,139.75 447.82,141.02 448.08,141.27 C7.1 | IC3.8 446.42,134.05 | C5.1 447.34,133.12 446.42,134.05 | v444.27,122.73 445.73,122.73 C4.1 R1.1 | v472.72,140 473.23,139.5 473.23,137.44 472.77,136.98 471.88,136.98 471.87,136.98 | v10.18,98.86 11.16,99.83 19.07,99.83 | 19.07,99.83 39.14,99.83 | 39.14,99.83 37.18,101.79 ESC.VDD | M6.VDD 19.07,100.76 19.07,99.83 | 466.28,101.08 466.28,100.59 465.53,99.83 447.57,99.83 | 466.28,101.08 466.28,101.14 | 39.14,99.83 56.25,99.83 | 56.25,99.83 75.3,99.83 | 75.3,99.83 94.35,99.83 | 94.35,99.83 113.4,99.83 | 113.4,99.83 132.45,99.83 | 132.45,99.83 151.5,99.83 | 151.5,99.83 170.55,99.83 | 170.55,99.83 189.6,99.83 | 189.6,99.83 208.65,99.83 | 208.65,99.83 227.7,99.83 | 227.7,99.83 246.75,99.83 | 246.75,99.83 265.8,99.83 | 265.8,99.83 284.85,99.83 | 284.85,99.83 303.9,99.83 | 303.9,99.83 327.72,99.83 | 327.72,99.83 346.76,99.83 | 346.76,99.83 365.81,99.83 | 365.81,99.83 389.63,99.83 | 389.63,99.83 408.68,99.83 | 408.68,99.83 427.73,99.83 | 427.73,99.83 447.57,99.83 | v10.44,81.08 13.39,81.08 13.68,80.78 19.07,80.78 | 19.07,80.78 38.38,80.78 | M5.VDD 19.07,81.71 19.07,80.78 | GRAVE.VDD 38.38,81.45 38.38,80.78 | v10.44,62.28 13.14,62.28 13.68,61.73 18.15,61.73 | 18.15,61.73 23.61,61.73 23.64,61.77 37.45,61.77 37.49,61.73 41.97,61.73
  Bottom 0.406: 41.97,61.73 65.78,61.73 | 65.78,61.73 84.83,61.73 | 84.83,61.73 103.88,61.73 | 103.88,61.73 122.93,61.73 | 122.93,61.73 141.98,61.73 | 141.98,61.73 161.03,61.73 | 161.03,61.73 180.08,61.73 | 180.08,61.73 199.13,61.73 | 199.13,61.73 218.18,61.73 | 218.18,61.73 237.23,61.73 | 237.23,61.73 256.28,61.73 | 256.28,61.73 275.33,61.73 | 275.33,61.73 300.25,61.73 | 300.25,61.73 327.72,61.73 | 327.72,61.73 346.76,61.73 | 346.76,61.73 365.81,61.73 | 365.81,61.73 389.63,61.73 | 389.63,61.73 409.73,61.73 | 409.73,61.73 427.73,61.73 | 427.73,61.73 434.36,61.73 438.43,65.8 438.43,65.84 442.75,70.15 448.59,70.15 457.73,61.01 465.86,61.01 467.14,62.3 | v10.44,43.48 12.88,43.48 13.68,42.68 18.15,42.68 | 103.25,42.68 | 103.25,42.68 107.69,42.68 | 107.69,42.68 127.69,42.68 | 127.69,42.68 146.74,42.68 | 146.74,42.68 165.79,42.68 | 165.79,42.68 184.84,42.68 | 184.84,42.68 203.89,42.68 | 203.89,42.68 222.94,42.68 | 222.94,42.68 241.99,42.68 | 241.99,42.68 261.04,42.68 | 261.04,42.68 268.61,42.68 271.28,45.35 274.71,45.35 277.64,42.42 288.06,42.34 289.07,42.34 289.84,42.33 291.28,42.32 294.57,45.61 298.18,45.61 301.39,42.68 389.63,42.68 | 18.15,42.68 44.35,42.68 | 44.35,42.68 70.54,42.68 | 70.54,42.68 89.59,42.68 | 89.59,42.68 103.25,42.68 | v10.44,24.69 12.63,24.69 13.68,23.63 18.15,23.63 | 18.15,23.63 28.94,23.63 32.03,26.72 38.12,26.72 41.34,23.51 49.11,23.51 | 49.11,23.51 53.2,23.51 56.41,26.72 60.73,26.72 64.03,23.42 80.06,23.42 | 80.06,23.42 99.12,23.42 | 99.12,23.42 118.17,23.42 | 118.17,23.42 137.22,23.42 | 137.22,23.42 156.26,23.42 | 156.26,23.42 175.31,23.42 | 175.31,23.42 194.37,23.42 | 194.37,23.42 213.41,23.42 | 213.41,23.42 232.47,23.42
  Bottom 0.406: 232.47,23.42 251.52,23.42 | 251.52,23.42 261.64,23.42 264.94,26.72 271.04,26.72 274.34,23.42 282.66,23.42 | 415.02,23.63 415.06,23.67 | 282.66,23.42 286.79,23.42 290.09,26.72 295.43,26.72 298.51,23.63 349.15,23.63 | 349.15,23.63 389.63,23.63 | 389.63,23.63 409.73,23.63 | 409.73,23.63 415.02,23.63 | v10.18,7.67 14.5,3.35 18.15,3.35 | 18.15,3.35 39.58,3.35 | 39.58,3.35 63.4,3.35 | 63.4,3.35 87.21,3.35 | 87.21,3.35 100.86,3.35 104.92,7.42 107.97,7.42 112.04,3.35 163.73,3.35 | 230.08,3.35 211.86,3.35 207.8,7.42 205,7.42 200.94,3.35 163.73,3.35 | 230.08,3.35 253.9,3.35 | 253.9,3.35 277.71,3.35 | 277.71,3.35 327.72,3.35 | 327.72,3.35 346.76,3.35 | 346.76,3.35 365.81,3.35 | 365.81,3.35 379.5,3.35 383.56,7.42 386.61,7.42 390.68,3.35 399.15,3.35 | 427.73,3.35 414.3,3.35 410.23,7.42 407.44,7.42 403.38,3.35 399.15,3.35 | 427.73,3.35 466.37,3.35 467.64,4.62 467.64,5.64 467.73,5.83 468.29,6.38 | 467.14,62.3 467.38,62.53 | 389.63,42.68 427.73,42.68 | 427.73,42.68 465.83,42.68 | 465.83,42.68 468.62,42.68 468.65,42.72 468.84,42.82 470.91,44.88 470.91,50.6 469.48,52.03 466.14,52.03 462.49,55.68 446.78,55.68 PLUS2.DOUT | 38.38,80.78 56.25,80.78 | 56.25,80.78 75.3,80.78 | 75.3,80.78 94.35,80.78 | 94.35,80.78 113.4,80.78 | 113.4,80.78 132.45,80.78 | 132.45,80.78 151.5,80.78 | 151.5,80.78 170.55,80.78 | 170.55,80.78 189.6,80.78 | 189.6,80.78 208.65,80.78 | 208.65,80.78 227.7,80.78 | 227.7,80.78 246.75,80.78 | 246.75,80.78 265.8,80.78 | 265.8,80.78 275.07,80.78 278.1,83.82 282.29,83.82 282.3,83.83 282.48,83.82 282.67,83.82 286.23,80.26 295.68,80.26 | 295.68,80.26 298.79,80.26 302.35,83.82 305.92,83.82 305.92,83.83 306.1,83.82 306.28,83.82 306.29,83.81 306.3,83.81 306.42,83.68 306.55,83.55 306.55,83.54 308.97,80.9 309.1,80.77 327.72,80.77
  Bottom 0.406: 327.72,80.77 346.76,80.77 | 346.76,80.77 365.81,80.77 | 365.81,80.77 389.63,80.77 | 389.63,80.77 409.22,80.77 | 409.22,80.77 427.73,80.77 | 427.73,80.77 446.78,80.77 | 446.78,80.77 466.57,80.77 467.64,81.84 467.64,82.6 467.5,82.74 UNDERSCORE.VDD | 415.02,23.63 427.73,23.63 | 427.73,23.63 431.53,23.63 442.49,34.59 445.79,34.59 457.73,22.66 465.35,22.66 467.02,24.32 | 467.02,24.32 467.13,24.43 | v446.4,134.06 446.46,134.1 446.42,134.05 | 18.15,3.35 18.15,6.46 CTRL1.VDD | 39.58,3.35 39.58,6.46 CTRL.VDD | 63.4,3.35 63.4,6.46 WIN.VDD | 87.21,3.35 87.21,6.46 ALT.VDD | 230.08,3.35 230.08,6.46 ALT2.VDD | 253.9,3.35 253.9,6.46 WIN2.VDD | 277.71,3.35 277.71,6.46 MENU.VDD | 18.15,23.63 18.15,25.51 M2.VDD | 18.15,42.68 18.15,44.56 M3.VDD | 49.11,23.51 49.11,25.51 SHIFT.VDD | 44.35,42.68 44.35,44.56 CAPSLOCK.VDD | 80.06,23.42 80.06,25.51 Z.VDD | 70.54,42.68 70.54,44.56 A.VDD | 99.12,23.42 99.12,25.51 X.VDD | 89.59,42.68 89.59,44.56 S.VDD | 118.17,23.42 118.17,25.51 C.VDD | 107.69,42.68 107.69,44.56 D.VDD | 137.22,23.42 137.22,25.51 V.VDD | SPACE.DIN 158.65,7.89 159.28,7.89 163.73,3.45 163.73,3.35 | 127.69,42.68 127.69,44.56 F.VDD | 156.26,23.42 156.26,25.51 B.VDD | 146.74,42.68 146.74,44.56 G.VDD | 175.31,23.42 175.31,25.51 N.VDD | 165.79,42.68 165.79,44.56 H.VDD | 194.37,23.42 194.37,25.51 M.VDD | 184.84,42.68 184.84,44.56 J.VDD | 213.41,23.42 213.41,25.51 COMMA.VDD | 203.89,42.68 203.89,44.56 K.VDD | 232.47,23.42 232.47,25.51 PERIOD.VDD | 222.94,42.68 222.94,44.56 L.VDD | 241.99,42.68 241.99,44.56 SEMICOLON.VDD | 18.15,61.73 18.15,63.61 M4.VDD | 41.97,61.73 41.97,63.61 TAB.VDD | 65.78,61.73 65.78,63.61 Q.VDD | 56.25,80.78 56.25,82.66 1.VDD
  Bottom 0.406: 84.83,61.73 84.83,63.61 W.VDD | 56.25,99.83 56.25,101.71 F1.VDD | 75.3,80.78 75.3,82.66 2.VDD | 103.88,61.73 103.88,63.61 E.VDD | 94.35,80.78 94.35,82.66 3.VDD | 75.3,99.83 75.3,101.71 F2.VDD | 122.93,61.73 122.93,63.61 R.VDD | 94.35,99.83 94.35,101.71 F3.VDD | 113.4,80.78 113.4,82.66 4.VDD | 141.98,61.73 141.98,63.61 T.VDD | 132.45,80.78 132.45,82.66 5.VDD | 113.4,99.83 113.4,101.71 F4.VDD | 161.03,61.73 161.03,63.61 Y.VDD | 132.45,99.83 132.45,101.71 F5.VDD | 151.5,80.78 151.5,82.66 6.VDD | 180.08,61.73 180.08,63.61 U.VDD | 170.55,80.78 170.55,82.66 7.VDD | 151.5,99.83 151.5,101.71 F6.VDD | 170.55,99.83 170.55,101.71 F7.VDD | 189.6,80.78 189.6,82.66 8.VDD | 189.6,99.83 189.6,101.71 F8.VDD | 199.13,61.73 199.13,63.61 I.VDD | 208.65,80.78 208.65,82.66 9.VDD | 218.18,61.73 218.18,63.61 O.VDD | 237.23,61.73 237.23,63.61 P.VDD | 251.52,23.42 251.52,25.51 SLASH.VDD | 261.04,42.68 261.04,44.56 QUOTE.VDD | 208.65,99.83 208.65,101.71 F9.VDD | 282.66,23.42 282.66,25.16 SHIFT2.VDD | 227.7,80.78 227.7,82.66 0.VDD | 256.28,61.73 256.28,63.61 LBRACKET.VDD | 246.75,80.78 246.75,83.3 DASH.VDD | 227.7,99.83 227.7,101.71 F10.VDD | 327.72,3.35 327.72,6.46 LEFT.VDD | 275.33,61.73 275.33,63.61 RBRACKET.VDD | 246.75,99.83 246.75,101.71 F11.VDD | 265.8,80.78 265.8,82.66 EQUAL.VDD | 346.76,3.35 346.76,6.46 DOWN.VDD | 265.8,99.83 265.8,101.71 F12.VDD | 365.81,3.35 365.81,6.46 RIGHT.VDD | UP.VDD 346.76,25.51 347.4,25.51 349.15,23.77 349.15,23.63 | 284.85,99.83 284.85,101.71 VOLUMEUP.VDD | 327.72,61.73 327.72,63.61 DELETE.VDD | 303.9,99.83 303.9,101.71 VOLUMNEDOWN.VDD | 399.15,3.35 399.15,6.46 KP_0.VDD | 346.76,61.73 346.76,63.61 END.VDD
  Bottom 0.406: 327.72,80.77 327.72,82.66 INSERT.VDD | 389.63,23.63 389.63,25.51 KP_1.VDD | 365.81,61.73 365.81,63.61 PGDN.VDD | 327.72,99.83 327.72,101.71 PRTSC.VDD | 346.76,80.77 346.76,82.66 HOME.VDD | 427.73,3.35 427.73,6.46 KP_DEL.VDD | 389.63,42.68 389.63,44.56 KP_4.VDD | 365.81,80.77 365.81,82.66 PGUP.VDD | 346.76,99.83 346.76,101.71 SCROLLLOCK.VDD | 427.73,23.63 427.73,25.51 KP_3.VDD | 389.63,61.73 389.63,63.61 KP_7.VDD | 468.29,6.38 470.91,9 470.91,12.5 469.48,13.93 466.14,13.93 462.49,17.58 446.78,17.58 ENTER2.DOUT | 365.81,99.83 365.81,101.71 PAUSE.VDD | 427.73,42.68 427.73,44.56 KP_6.VDD | 389.63,80.77 389.63,82.66 NUMLOCK.VDD | 427.73,61.73 427.73,63.61 KP_9.VDD | 389.63,99.83 389.63,101.71 BACKSONG.VDD | 408.68,99.83 408.68,101.71 PAUSEPLAY.VDD | 427.73,80.77 427.73,82.66 KP_ASTERISK.VDD | 446.78,80.77 446.78,82.66 KP_DASH.VDD | 427.73,99.83 427.73,101.71 NEXTSONG.VDD | 447.57,99.83 RANDSONG.VDD | LOCK.VDD 465.51,101.71 466.14,101.08 466.28,101.08 | BACKSPACE_1.VDD 465.83,6.46 468.21,6.46 468.29,6.38 | 467.02,24.32 465.83,25.51 KP_DELETE2.VDD | 465.83,42.68 465.83,44.56 KP_62.VDD | 467.14,62.3 465.83,63.61 KP_5.VDD | BACKSPACE.VDD 295.68,81.33 295.68,80.26 | BACKSLASH.VDD 300.25,62.47 300.25,61.73 | KP_SLASH.VDD 409.22,82.09 409.22,80.77 | KP_8.VDD 409.73,62.54 409.73,61.73 | KP_2.VDD 409.73,24.44 409.73,23.63
CC1  (via drill 0.35)
  Top 0.2: v462.3,138.23 448.08,138.23 446.56,139.75 446.56,140.26 446.18,140.64 444.65,140.64 444.22,141.07 444.22,142.22 442.91,143.53 442.26,143.53 441.73,144.07 440.2,144.07 v439.95,143.81
  Bottom 0.2: J1.A5 467.1,139.23 R5.1 463.36,139.28 v462.3,138.23 | IC3.61 440.7,142.27 439.95,143.02 v439.95,143.81
CC2  (via drill 0.35)
  Top 0.2: v477.04,144.32 477.04,141.53 473.23,137.72 v472.46,137.72
  Bottom 0.2: J1.B5 472.23,137.48 v472.46,137.72 | IC3.60 439.95,141.45 439.95,142.29 439.19,143.05 439.19,144.32 439.49,144.63 446.5,144.63 447.82,143.31 449.6,143.31 450.37,142.54 452.4,142.54 453.67,141.27 464.96,141.27 469.16,145.48 469.16,146.1 469.42,146.35 471.45,146.35 472.3,145.51 R6.2 473.31,145.85 475.51,145.85 v477.04,144.32
COL2  (via drill 0.35)
  Top 0.2: v429.77,143.06 425.22,143.06 | 425.22,143.06 | 425.22,143.06 421.38,143.06 416.42,138.1 416.42,135.05 408.77,127.4 29.82,127.4 M6.ALPS1 13.44,110.87 M6.MX1 11.48,109.02 10.06,109.02 8.79,107.75 8.79,102.83 13.39,98.22 13.39,92.03 M5.ALPS1 13.55,91.87 12.28,90.6 M5.MX1 | M4.MX1 12.28,71.55 13.55,72.82 M4.ALPS1 | M3.MX1 12.28,52.5 13.55,53.77 M3.ALPS1 | CTRL1.MX1 12.28,14.4 13.55,15.67 CTRL1.ALPS1 | M2.MX1 12.28,33.45 13.55,34.72 M2.ALPS1
  Bottom 0.2: IC3.50 432.04,142.07 431.05,143.06 v429.77,143.06 | 8.79,31.55 8.79,25.36 13.39,20.75 13.39,15.83 CTRL1.ALPS1 | 8.79,31.55 10.53,33.29 12.12,33.29 M2.MX1 | 8.79,50.6 10.53,52.34 12.12,52.34 M3.MX1 | 8.79,31.55 8.79,50.6 | 8.79,69.65 10.53,71.39 12.12,71.39 M4.MX1 | 8.79,50.6 8.79,69.65 | 8.79,69.65 8.79,88.7 10.53,90.44 12.12,90.44 M5.MX1
COL3  (via drill 0.35)
  Top 0.2: v429.79,142.14 421.76,142.14 417.35,137.72 417.35,134.92 409.33,126.91 48.53,126.91 32.65,111.03 | 32.65,111.03 ESC.MX1 30.61,108.98 29.1,108.98 27.95,107.83 27.95,106.2 30,104.15 v30,98.73 | GRAVE.MX1 30.61,89.93 29.1,89.93 27.95,88.78 27.95,87.15 29.49,85.61 v29.49,79.55 | TAB.ALPS1 37.36,72.82 36.09,71.55 TAB.MX1 35.93,71.39 34.34,71.39 32.6,69.65 32.6,60.91 v33.39,60.12 | 32.65,111.03 32.6,111.08 ESC.ALPS1 | CAPSLOCK.ALPS1 39.74,53.77 38.47,52.5 CAPSLOCK.MX1 38.31,52.34 36.73,52.34 34.98,50.6 34.98,44.25 v38.47,40.75 | CTRL.MX1 33.71,14.4 34.98,15.67 CTRL.ALPS1 | SHIFT.ALPS1 44.5,34.72 43.23,33.45 SHIFT.MX1 43.08,33.29 41.49,33.29 39.74,31.55 39.74,30.43 39.9,30.28 v39.9,22.97
  Bottom 0.2: IC3.49 430.53,142.14 v429.79,142.14 | v30,98.73 30,96.57 32.49,94.07 GRAVE.ALPS1 32.49,91.82 GRAVE.MX1 | v29.49,79.55 30.62,79.55 TAB.ALPS1 | v39.9,22.97 34.98,18.05 34.98,15.83 CTRL.ALPS1 | v38.47,40.75 44.35,34.88 SHIFT.ALPS1 | v33.39,60.12 39.58,53.93 CAPSLOCK.ALPS1
COL4  (via drill 0.35)
  Top 0.2: v427.25,140.35 421.25,140.35 418.11,137.21 418.11,134.67 409.83,126.39 66.92,126.39 F1.ALPS1 50.23,109.71 F1.MX1 49.66,108.98 48.15,108.98 47,107.83 47,106.2 49.55,103.64 v49.55,98.73 | A.ALPS1 65.94,53.77 64.67,52.5 A.MX1 64.51,52.34 62.92,52.34 61.17,50.6 61.17,46.31 v66.73,40.75 | Q.ALPS1 61.17,72.82 59.9,71.55 Q.MX1 59.75,71.39 58.16,71.39 56.41,69.65 56.41,68.06 59.11,65.36 v59.11,60.6 | WIN.MX1 57.52,14.4 58.79,15.67 WIN.ALPS1 | Z.ALPS1 75.46,34.72 74.19,33.45 Z.MX1 74.03,33.29 72.44,33.29 65.14,25.99 v65.14,22.18 | v61.17,79.65 61.17,88.7 58.95,90.92 55.14,90.92 54.19,91.87 51.65,91.87 1.ALPS1
  Bottom 0.2: IC3.48 428.04,139.56 v427.25,140.35 | v49.55,98.73 51.54,96.75 1.ALPS1 50.23,90.66 1.MX1 | v59.11,60.6 65.78,53.93 A.ALPS1 | v65.14,22.18 58.79,15.83 WIN.ALPS1 | v66.73,40.75 74.03,33.45 Z.MX1 | v61.17,79.65 61.17,72.98 Q.ALPS1
COL5  (via drill 0.35)
  Top 0.2: v427.25,139.44 421.36,139.44 418.87,136.96 418.87,134.42 410.38,125.93 85.51,125.93 F2.ALPS1 70.59,110.87 F2.MX1 69.27,109.49 67.68,109.49 65.94,107.75 65.94,104.73 70.54,100.13 v70.54,98.7 | ALT.MX1 81.33,14.4 82.61,15.67 ALT.ALPS1 | X.ALPS1 94.51,34.72 93.24,33.45 X.MX1 93.08,33.29 91.5,33.29 82.61,24.4 v82.61,22.18 | 70.7,91.87 69.43,90.6 2.MX1 | 84.99,53.77 83.72,52.5 S.MX1 | W.ALPS1 80.22,72.82 78.95,71.55 W.MX1 78.8,71.39 77.21,71.39 75.46,69.65 75.46,68.06 78.16,65.36 v78.16,60.6 | 70.7,91.87 74.03,91.87 75.94,89.97 78.95,89.97 80.22,88.7 v80.22,79.33 | 70.7,91.87 2.ALPS1 | v94.51,41.55 94.51,50.76 92.45,52.82 88.48,52.82 87.53,53.77 84.99,53.77 | 84.99,53.77 S.ALPS1
  Bottom 0.2: IC3.47 427.92,138.77 v427.25,139.44 | v82.61,22.18 82.61,15.83 ALT.ALPS1 | v70.54,98.7 70.54,92.03 2.ALPS1 | v78.16,60.6 84.83,53.93 S.ALPS1 | v80.22,79.33 80.22,72.98 W.ALPS1 | v94.51,41.55 94.51,34.88 X.ALPS1
COL6  (via drill 0.35)
  Top 0.2: v427.25,138.53 421.46,138.53 419.63,136.7 419.63,134.16 410.94,125.48 104.1,125.48 F3.ALPS1 89.64,110.87 F3.MX1 88.32,109.49 86.73,109.49 84.99,107.75 84.99,104.73 89.59,100.13 v89.59,98.7 | 89.75,91.87 88.48,90.6 3.MX1 | C.MX1 112.29,33.45 113.56,34.72 C.ALPS1 | E.ALPS1 99.27,72.82 98,71.55 E.MX1 97.84,71.39 96.26,71.39 94.51,69.65 94.51,62.34 v96.73,60.12 | 103.08,53.77 101.81,52.5 D.MX1 | v113.4,41.55 113.4,49.96 110.55,52.82 106.58,52.82 105.62,53.77 103.08,53.77 | 103.08,53.77 D.ALPS1 | 89.75,91.87 93.08,91.87 94.99,89.97 98,89.97 99.27,88.7 v99.27,79.33 | 89.75,91.87 3.ALPS1
  Bottom 0.2: IC3.46 427.8,137.99 v427.25,138.53 | v89.59,98.7 89.59,92.03 3.ALPS1 | v96.73,60.12 102.92,53.93 D.ALPS1 | v113.4,41.55 113.4,34.88 C.ALPS1 | v99.27,79.33 99.27,72.98 E.ALPS1
COL7  (via drill 0.35)
  Top 0.2: v427.22,137.62 427.09,137.62 426.74,137.97 421.92,137.97 420.39,136.45 420.39,133.91 411.5,125.02 122.69,125.02 F4.ALPS1 108.69,110.87 F4.MX1 107.37,109.49 105.78,109.49 104.04,107.75 104.04,104.73 108.64,100.13 v108.64,98.7 | 108.8,91.87 107.53,90.6 4.MX1 | V.MX1 131.34,33.45 132.61,34.72 V.ALPS1 | R.ALPS1 118.32,72.82 117.05,71.55 R.MX1 116.9,71.39 115.31,71.39 113.56,69.65 113.56,63.3 v116.74,60.12 | 123.09,53.77 121.82,52.5 F.MX1 | v132.61,41.55 132.61,50.76 130.55,52.82 126.58,52.82 125.63,53.77 123.09,53.77 | 123.09,53.77 F.ALPS1 | 108.8,91.87 112.13,91.87 114.04,89.97 117.05,89.97 118.32,88.7 v118.32,79.33 | 108.8,91.87 4.ALPS1
  Bottom 0.2: IC3.45 427.65,137.2 v427.22,137.62 | v108.64,98.7 108.64,92.03 4.ALPS1 | v116.74,60.12 122.93,53.93 F.ALPS1 | v132.61,41.55 132.61,34.88 V.ALPS1 | v118.32,79.33 118.32,72.98 R.ALPS1
COL8  (via drill 0.35)
  Top 0.2: v425.5,137.13 422.1,137.13 421.16,136.19 421.16,133.65 411.99,124.48 141.21,124.48 F5.ALPS1 127.74,110.87 F5.MX1 126.42,109.49 124.83,109.49 123.09,107.75 123.09,104.73 127.69,100.13 v127.69,98.7 | SPACE.MX1 152.77,14.4 154.04,15.67 SPACE.ALPS1 | B.ALPS1 151.66,34.72 150.39,33.45 B.MX1 150.23,33.29 148.65,33.29 146.9,31.55 146.9,28.53 v153.88,21.54 | 127.85,91.87 126.58,90.6 5.MX1 | 142.14,53.77 140.87,52.5 G.MX1 | T.ALPS1 137.37,72.82 136.1,71.55 T.MX1 135.94,71.39 134.36,71.39 132.61,69.65 132.61,68.06 135.31,65.36 v135.31,60.6 | 127.85,91.87 131.18,91.87 133.09,89.97 136.1,89.97 137.37,88.7 v137.37,79.33 | 127.85,91.87 5.ALPS1 | v151.66,41.55 151.66,50.76 149.6,52.82 145.63,52.82 144.68,53.77 142.14,53.77 | 142.14,53.77 G.ALPS1
  Bottom 0.2: IC3.44 427.8,136.41 427.25,136.96 425.5,136.96 v425.5,137.13 | v153.88,21.54 153.88,15.83 SPACE.ALPS1 | v127.69,98.7 127.69,92.03 5.ALPS1 | v135.31,60.6 141.98,53.93 G.ALPS1 | v137.37,79.33 137.37,72.98 T.ALPS1 | v151.66,41.55 151.66,34.88 B.ALPS1
COL9  (via drill 0.35)
  Top 0.2: v425.47,134.16 425.47,133.65 415.77,123.95 159.88,123.95 146.95,111.03 | 146.95,111.03 F6.MX1 145.47,109.49 143.88,109.49 142.14,107.75 v142.14,98.7 | F6.ALPS1 146.9,111.08 146.95,111.03 | 146.9,91.87 145.63,90.6 6.MX1 | N.MX1 169.44,33.45 170.71,34.72 N.ALPS1 | Y.ALPS1 156.42,72.82 155.15,71.55 Y.MX1 155,71.39 153.41,71.39 151.66,69.65 151.66,63.3 v154.84,60.12 | 161.19,53.77 159.92,52.5 H.MX1 | v170.71,41.55 170.71,50.76 168.65,52.82 164.68,52.82 163.73,53.77 161.19,53.77 | 161.19,53.77 H.ALPS1 | 146.9,91.87 150.23,91.87 152.14,89.97 155.15,89.97 156.42,88.7 v156.42,79.33 | 146.9,91.87 6.ALPS1
  Bottom 0.2: IC3.42 428.18,134.84 427.79,134.44 425.75,134.44 v425.47,134.16 | v142.14,98.7 142.14,96.63 146.74,92.03 6.ALPS1 | v154.84,60.12 161.03,53.93 H.ALPS1 | v170.71,41.55 170.71,34.88 N.ALPS1 | v156.42,79.33 156.42,72.98 Y.ALPS1
COL10  (via drill 0.35)
  Top 0.2: v427.25,133.81 426.97,133.53 426.11,133.53 416.02,123.44 178.27,123.44 F7.ALPS1 165.84,110.87 F7.MX1 164.52,109.49 162.93,109.49 161.19,107.75 161.19,104.73 165.79,100.13 v165.79,98.7 | 165.95,91.87 164.68,90.6 7.MX1 | M.MX1 188.49,33.45 189.76,34.72 M.ALPS1 | U.ALPS1 175.47,72.82 174.2,71.55 U.MX1 174.05,71.39 172.46,71.39 170.71,69.65 170.71,63.3 v173.89,60.12 | 180.24,53.77 178.97,52.5 J.MX1 | v189.76,41.55 189.76,50.76 187.7,52.82 183.73,52.82 182.78,53.77 180.24,53.77 | 180.24,53.77 J.ALPS1 | 165.95,91.87 169.28,91.87 171.19,89.97 174.2,89.97 175.47,88.7 v175.47,79.33 | 165.95,91.87 7.ALPS1
  Bottom 0.2: IC3.41 427.49,134.05 v427.25,133.81 | v165.79,98.7 165.79,92.03 7.ALPS1 | v173.89,60.12 180.08,53.93 J.ALPS1 | v189.76,41.55 189.76,34.88 M.ALPS1 | v175.47,79.33 175.47,72.98 U.ALPS1
COL11  (via drill 0.35)
  Top 0.2: v427.25,132.9 426.25,132.9 416.33,122.99 196.86,122.99 F8.ALPS1 184.89,110.87 F8.MX1 183.57,109.49 181.98,109.49 180.24,107.75 180.24,104.73 184.84,100.13 v184.84,98.7 | 185,91.87 183.73,90.6 8.MX1 | COMMA.MX1 207.54,33.45 208.81,34.72 COMMA.ALPS1 | I.ALPS1 194.52,72.82 193.25,71.55 I.MX1 193.09,71.39 191.51,71.39 189.76,69.65 189.76,63.3 v192.94,60.12 | 199.29,53.77 198.02,52.5 K.MX1 | v208.81,41.55 208.81,50.76 206.75,52.82 202.78,52.82 201.83,53.77 199.29,53.77 | 199.29,53.77 K.ALPS1 | 185,91.87 188.33,91.87 190.24,89.97 193.25,89.97 194.52,88.7 v194.52,79.33 | 185,91.87 8.ALPS1
  Bottom 0.2: IC3.40 427.61,133.26 v427.25,132.9 | v184.84,98.7 184.84,92.03 8.ALPS1 | v192.94,60.12 199.13,53.93 K.ALPS1 | v208.81,41.55 208.81,34.88 COMMA.ALPS1 | v194.52,79.33 194.52,72.98 I.ALPS1
COL12  (via drill 0.35)
  Top 0.2: v427.25,132 426.28,132 416.86,122.58 215.5,122.58 F9.ALPS1 203.94,110.87 F9.MX1 202.62,109.49 201.03,109.49 199.29,107.75 199.29,104.73 203.89,100.13 v203.89,98.7 | ALT2.MX1 224.21,14.4 225.48,15.67 ALT2.ALPS1 | PERIOD.ALPS1 227.86,34.72 226.59,33.45 PERIOD.MX1 226.43,33.29 224.84,33.29 223.1,31.55 223.1,29.96 225.32,27.74 v225.32,22.18 | 204.05,91.87 202.78,90.6 9.MX1 | 218.34,53.77 217.07,52.5 L.MX1 | O.ALPS1 213.57,72.82 212.3,71.55 O.MX1 212.15,71.39 210.56,71.39 208.81,69.65 208.81,68.06 211.51,65.36 v211.51,60.6 | 204.05,91.87 207.38,91.87 209.29,89.97 212.3,89.97 213.57,88.7 v213.57,79.33 | 204.05,91.87 9.ALPS1 | v227.86,41.55 227.86,50.76 225.8,52.82 221.83,52.82 220.88,53.77 218.34,53.77 | 218.34,53.77 L.ALPS1
  Bottom 0.2: IC3.39 427.73,132.47 v427.25,132 | v225.32,22.18 225.32,15.83 ALT2.ALPS1 | v203.89,98.7 203.89,92.03 9.ALPS1 | v211.51,60.6 218.18,53.93 L.ALPS1 | v213.57,79.33 213.57,72.98 O.ALPS1 | v227.86,41.55 227.86,34.88 PERIOD.ALPS1
COL13  (via drill 0.35)
  Top 0.2: v427.25,131.09 426.16,131.09 417.22,122.15 234.12,122.15 F10.ALPS1 222.99,110.87 F10.MX1 221.67,109.49 220.08,109.49 218.34,107.75 218.34,104.73 222.94,100.13 v222.94,98.7 | WIN2.MX1 248.02,14.4 249.29,15.67 WIN2.ALPS1 | SLASH.ALPS1 246.91,34.72 245.64,33.45 SLASH.MX1 245.48,33.29 243.9,33.29 242.15,31.55 242.15,28.53 v249.13,21.54 | 223.1,91.87 221.83,90.6 0.MX1 | 237.39,53.77 236.12,52.5 SEMICOLON.MX1 | P.ALPS1 232.62,72.82 231.35,71.55 P.MX1 231.19,71.39 229.61,71.39 227.86,69.65 227.86,68.06 230.56,65.36 v230.56,60.6 | 223.1,91.87 226.43,91.87 228.34,89.97 231.35,89.97 232.62,88.7 v232.62,79.33 | 223.1,91.87 0.ALPS1 | v246.91,41.55 246.91,50.76 244.85,52.82 240.88,52.82 239.93,53.77 237.39,53.77 | 237.39,53.77 SEMICOLON.ALPS1
  Bottom 0.2: IC3.38 429.33,131.62 427.79,131.62 v427.25,131.09 | v249.13,21.54 249.13,15.83 WIN2.ALPS1 | v222.94,98.7 222.94,92.03 0.ALPS1 | v230.56,60.6 237.23,53.93 SEMICOLON.ALPS1 | v232.62,79.33 232.62,72.98 P.ALPS1 | v246.91,41.55 246.91,34.88 SLASH.ALPS1
COL14  (via drill 0.35)
  Top 0.2: v427.25,130.18 426.15,130.18 417.69,121.72 252.74,121.72 F11.ALPS1 240.73,109.71 F11.MX1 240.72,109.49 239.13,109.49 237.39,107.75 237.39,104.73 241.99,100.13 v241.99,98.7 | 242.15,92.51 240.88,91.24 DASH.MX1 | MENU.MX1 271.83,14.4 273.1,15.67 MENU.ALPS1 | LBRACKET.ALPS1 251.67,72.82 250.4,71.55 LBRACKET.MX1 250.25,71.39 248.66,71.39 246.91,69.65 246.91,63.3 v250.09,60.12 | QUOTE.ALPS1 256.44,53.77 255.17,52.5 QUOTE.MX1 255.01,52.34 253.42,52.34 251.67,50.6 251.67,47.58 v257.71,41.55 | v263.9,35.36 261.61,33.07 261.61,22.69 v260.85,21.93 | 242.15,92.51 245.32,92.51 247.23,90.6 250.4,90.6 251.67,89.33 v251.67,79.33 | 242.15,92.51 DASH.ALPS1
  Bottom 0.2: IC3.37 429.36,130.86 427.93,130.86 v427.25,130.18 | v241.99,98.7 241.99,92.67 DASH.ALPS1 | v250.09,60.12 256.28,53.93 QUOTE.ALPS1 | MENU.MX1 268.47,14.31 v260.85,21.93 | v257.71,41.55 v263.9,35.36 | v251.67,79.33 251.67,72.98 LBRACKET.ALPS1
COL15  (via drill 0.35)
  Top 0.2: v427.25,129.27 426.12,129.27 418.17,121.31 271.39,121.31 F12.ALPS1 261.09,110.87 F12.MX1 259.77,109.49 258.18,109.49 256.44,107.75 256.44,104.73 261.04,100.13 v261.04,98.7 | RBRACKET.MX1 269.45,71.55 270.72,72.82 RBRACKET.ALPS1 | 261.2,91.87 259.93,90.6 EQUAL.MX1 | v270.72,79.65 270.72,88.7 268.5,90.92 264.69,90.92 263.74,91.87 261.2,91.87 | 261.2,91.87 EQUAL.ALPS1
  Bottom 0.2: IC3.36 428.09,130.11 v427.25,129.27 | v261.04,98.7 261.04,92.03 EQUAL.ALPS1 | v270.72,79.65 270.72,72.98 RBRACKET.ALPS1
COL16  (via drill 0.35)
  Top 0.2: v427.25,128.36 426.17,128.36 418.72,120.91 290.04,120.91 VOLUMEUP.ALPS1 280.14,110.87 VOLUMEUP.MX1
  Bottom 0.2: IC3.35 428.22,129.32 v427.25,128.36
COL17  (via drill 0.35)
  Top 0.2: v427.25,127.45 426.14,127.45 419.2,120.51 308.69,120.51 VOLUMNEDOWN.ALPS1 299.19,110.87 VOLUMNEDOWN.MX1 297.87,109.49 296.28,109.49 289.77,102.98 v289.77,98.7 | BACKSPACE.ALPS1 289.77,91.87 288.5,90.6 BACKSPACE.MX1 287.6,91.27 286.84,91.27 284.55,88.98 284.55,87.59 287.26,84.88 v287.26,79.04 | BACKSLASH.ALPS1 294.54,72.82 293.27,71.55 BACKSLASH.MX1 293.11,71.39 291.52,71.39 288.5,68.38 v288.5,60.12 | CTRL2.MX1 295.65,14.4 296.92,15.67 CTRL2.ALPS1 | ENTER.ALPS1 282.31,53.77 281.04,52.5 ENTER.MX1 280.88,52.34 279.3,52.34 277.71,50.76 v277.71,39.64 | 278.06,34.72 277.69,34.35 SHIFT2.MX1 275.94,33.55 274.79,33.55 272.79,31.55 272.79,29.04 279.64,22.18 v283.14,22.18 | 277.82,34.48 SHIFT2.ALPS1
  Bottom 0.2: IC3.34 428.34,128.54 v427.25,127.45 | v289.77,98.7 289.77,92.03 BACKSPACE.ALPS1 | v277.71,39.64 277.71,39.4 275.54,37.23 SHIFT2.ALPS1 | CTRL2.MX1 291.01,14.31 v283.14,22.18 | v288.5,60.12 282.31,53.93 ENTER.ALPS1 | v287.26,79.04 287.26,71.55 293.11,71.55 BACKSLASH.MX1
COL18  (via drill 0.35)
  Top 0.2: v427.25,126.54 426.24,126.54 419.81,120.11 332.1,120.11 PRTSC.ALPS1 323,110.87 PRTSC.MX1 321.68,109.49 320.1,109.49 318.35,107.75 318.35,104.73 322.95,100.13 v322.95,98.7 | INSERT.ALPS1 323.11,91.87 321.84,90.6 INSERT.MX1 321.68,90.44 320.1,90.44 318.35,88.7 v318.35,79.33 | LEFT.MX1 321.84,14.4 323.11,15.67 LEFT.ALPS1 | DELETE.ALPS1 323.11,72.82 321.84,71.55 DELETE.MX1 321.68,71.39 320.1,71.39 318.35,69.65 318.35,66.63 322.95,62.03 v322.95,60.6 | v322.95,39.17 v322.95,22.5 | v322.95,58.38 v322.95,41.23
  Bottom 0.2: IC3.33 428.46,127.75 v427.25,126.54 | v322.95,22.5 322.95,15.83 LEFT.ALPS1 | v322.95,41.23 v322.95,39.17 | v322.95,60.6 v322.95,58.38 | v318.35,79.33 318.35,77.58 322.95,72.98 DELETE.ALPS1 | v322.95,98.7 322.95,92.03 INSERT.ALPS1
COL19  (via drill 0.35)
  Top 0.2: v430.05,123.75 430.05,121.46 428.27,119.68 350.72,119.68 SCROLLLOCK.ALPS1 342.05,110.87 SCROLLLOCK.MX1 340.73,109.49 339.14,109.49 337.4,107.75 337.4,104.73 342,100.13 v342,98.7 | DOWN.MX1 340.89,14.4 342.16,15.67 DOWN.ALPS1 | UP.ALPS1 342.16,34.72 340.89,33.45 UP.MX1 340.73,33.29 339.14,33.29 337.4,31.55 337.4,28.53 342,23.93 v342,22.5 | END.ALPS1 342.16,72.82 340.89,71.55 END.MX1 340.73,71.39 339.14,71.39 337.4,69.65 337.4,66.63 342,62.03 v342,60.6 | HOME.ALPS1 342.16,91.87 340.89,90.6 HOME.MX1 340.73,90.44 339.14,90.44 337.4,88.7 337.4,85.68 342,81.08 v342,79.65 | v342,58.38 v342,41.23
  Bottom 0.2: IC3.32 431.25,124.83 430.17,123.75 v430.05,123.75 | v342,22.5 342,15.83 DOWN.ALPS1 | v342,79.65 342,72.98 END.ALPS1 | v342,41.23 342,34.88 UP.ALPS1 | v342,60.6 v342,58.38 | v342,98.7 342,92.03 HOME.ALPS1
COL20  (via drill 0.35)
  Top 0.2: v431.06,123.75 431.06,120.95 429.28,119.18 369.08,119.18 361.72,111.81 361.72,111.63 PAUSE.ALPS1 361.1,110.87 PAUSE.MX1 359.78,109.49 358.19,109.49 356.45,107.75 356.45,104.73 361.05,100.13 v361.05,98.7 | PGUP.ALPS1 361.21,91.87 359.94,90.6 PGUP.MX1 359.78,90.44 358.19,90.44 356.45,88.7 v356.45,79.33 | RIGHT.MX1 359.94,14.4 361.21,15.67 RIGHT.ALPS1 | PGDN.ALPS1 361.21,72.82 359.94,71.55 PGDN.MX1 359.78,71.39 358.19,71.39 356.45,69.65 356.45,66.63 361.05,62.03 v361.05,60.6 | v361.05,39.17 v361.05,22.5 | v361.05,58.38 v361.05,41.23
  Bottom 0.2: IC3.31 432.04,124.5 431.29,123.75 v431.06,123.75 | v361.05,22.5 361.05,15.83 RIGHT.ALPS1 | v361.05,41.23 v361.05,39.17 | v361.05,60.6 v361.05,58.38 | v356.45,79.33 356.45,77.58 361.05,72.98 PGDN.ALPS1 | v361.05,98.7 361.05,92.03 PGUP.ALPS1
COL21  (via drill 0.35)
  Top 0.2: v432.18,123.75 v432.18,123.74 432.18,120.8 430.05,118.67 392.57,118.67 BACKSONG.ALPS1 384.92,110.87 BACKSONG.MX1 383.6,109.49 382.01,109.49 380.26,107.75 v380.26,98.7 | NUMLOCK.ALPS1 385.02,91.87 383.75,90.6 NUMLOCK.MX1 383.6,90.44 382.01,90.44 380.26,88.7 v380.26,79.33 | KP_7.ALPS1 385.02,72.82 383.75,71.55 KP_7.MX1 383.6,71.39 382.01,71.39 380.26,69.65 v380.26,60.12 | KP_0.MX1 393.28,14.4 394.55,15.67 KP_0.ALPS1 | 385.02,34.72 383.75,33.45 KP_1.MX1 | KP_4.ALPS1 385.02,53.77 383.75,52.5 KP_4.MX1 383.6,52.34 382.01,52.34 380.26,50.6 380.26,47.58 384.87,42.98 v384.87,41.23 | v394.55,22.5 394.55,31.7 392.49,33.77 388.52,33.77 387.56,34.72 385.02,34.72 | 385.02,34.72 KP_1.ALPS1
  Bottom 0.2: IC3.30 432.83,124.39 v432.18,123.75 | v384.87,41.23 384.87,34.88 KP_1.ALPS1 | v394.55,22.5 394.55,15.83 KP_0.ALPS1 | v380.26,60.12 380.26,58.53 384.87,53.93 KP_4.ALPS1 | v380.26,79.33 380.26,77.58 384.87,72.98 KP_7.ALPS1 | v380.26,98.7 380.26,96.63 384.87,92.03 NUMLOCK.ALPS1
COL22  (via drill 0.35)
  Top 0.2: v433.09,123.75 433.09,120.45 430.81,118.16 411.12,118.16 PAUSEPLAY.ALPS1 403.97,110.87 PAUSEPLAY.MX1 402.64,109.49 401.06,109.49 399.31,107.75 v399.31,98.7 | KP_SLASH.ALPS1 404.07,91.87 402.8,90.6 KP_SLASH.MX1 402.64,90.44 401.06,90.44 399.31,88.7 v399.31,79.33 | KP_8.ALPS1 404.07,72.82 402.8,71.55 KP_8.MX1 402.64,71.39 401.06,71.39 399.31,69.65 v399.31,60.12 | KP_2.MX1 402.8,33.45 404.07,34.72 KP_2.ALPS1 | KP_52.ALPS1 404.07,53.77 402.8,52.5 KP_52.MX1 402.64,52.34 401.06,52.34 399.31,50.6 399.31,47.58 403.92,42.98 v403.92,41.23
  Bottom 0.2: v433.09,123.75 433.61,124.27 IC3.29 | v403.92,41.23 403.92,34.88 KP_2.ALPS1 | v399.31,60.12 399.31,58.53 403.92,53.93 KP_52.ALPS1 | v399.31,79.33 399.31,77.58 403.92,72.98 KP_8.ALPS1 | v399.31,98.7 399.31,96.63 403.92,92.03 KP_SLASH.ALPS1
COL23  (via drill 0.35)